# Altium schematic sheet 02 System_Block_Diagram.SchDoc: <Project Name>
size A3; ApprovedBy: <Appr.>; Author: <Author>; CompanyName: Infineon Technologies AG; Engineer: <Rel.>; Organization: Infineon Technologies AG; Address1: IFAG DES S PS; Address2: Am Campeon 1-12  -  85579 Neubiberg  -  Germany; Address3: 85579 Neubiberg; Address4: Germany; Revision: <Rev.>; SheetNumber: 2; Release: RC00; PageSetup: Record=PageOptions|CenterHorizontal=True|CenterVertical=True|PrintScale=1.01|XCorrection=1.00|YCorrection=1.00|PrintKind=0|BorderSize=5000000|LeftOffset=0|BottomOffset=0|Orientation=2|PaperLength=1000|PaperWidth=1000|Scale=100|PaperSource=7|PrintQuality=-4|MediaType=1|DitherType=10|PaperKind=A3|PrintScaleMode=1; Doc_ConfidentialStatus: <Doc_ConfidentialStatus>; Doc_Preliminary: <Doc_Preliminary>
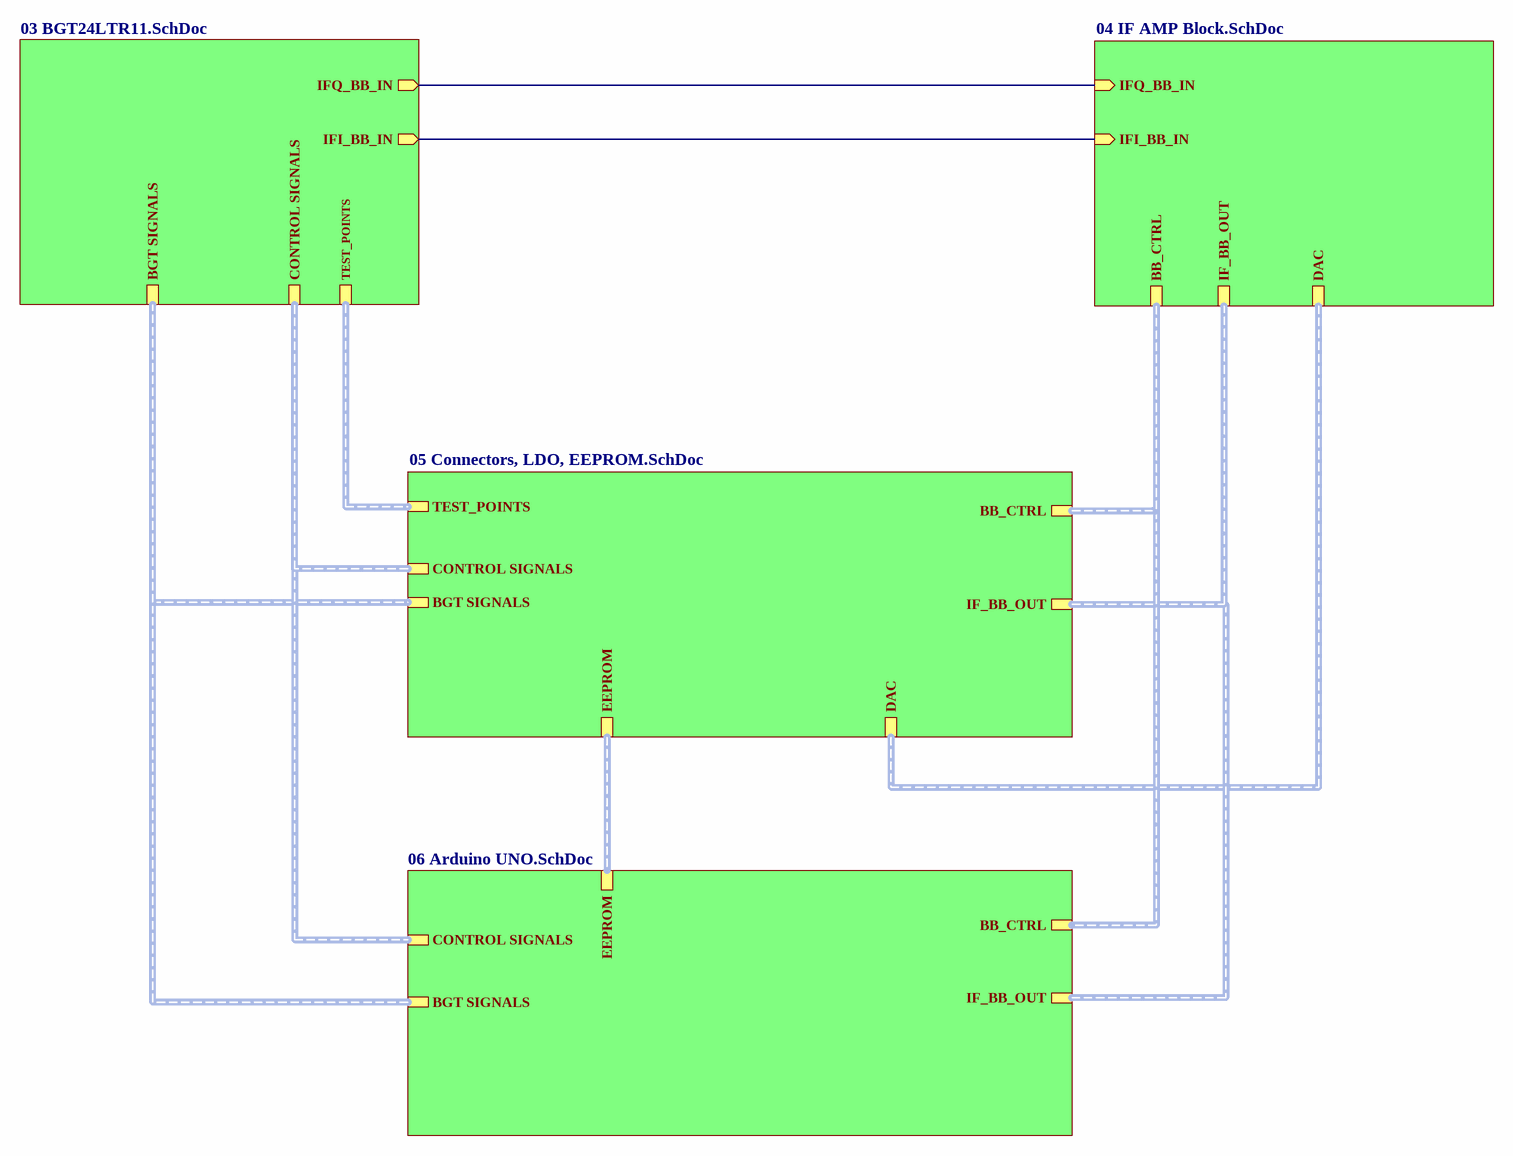
[diagram p0: 02 System_Block_Diagram.SchDoc]

## Sub-sheets
U_02 BGT24LTR11 = 03 BGT24LTR11.SchDoc: BGT SIGNALS (harness BGT_signals), CONTROL SIGNALS (harness BGT_CTRL), IFI_BB_IN (out), IFQ_BB_IN (out), TEST_POINTS (harness TEST_POINTS)
U_03 S&H, IF AMP Block = 04 IF AMP Block.SchDoc: DAC (harness DAC), IF_BB_OUT (harness IF_BB_OUT), BB_CTRL (harness BB_CTRL), IFQ_BB_IN (in), IFI_BB_IN (in)
U_04 Connector & Level Shifter Block = 05 Connectors, LDO, EEPROM.SchDoc: EEPROM (harness EEPROM), CONTROL SIGNALS (harness BGT_CTRL), DAC (harness DAC), BGT SIGNALS (harness BGT_signals), IF_BB_OUT (harness IF_BB_OUT), BB_CTRL (harness BB_CTRL), TEST_POINTS (harness TEST_POINTS)
U_05 Arduino UNO = 06 Arduino UNO.SchDoc: EEPROM (harness EEPROM), BGT SIGNALS (harness BGT_signals), IF_BB_OUT (harness IF_BB_OUT), CONTROL SIGNALS (harness BGT_CTRL), BB_CTRL (harness BB_CTRL)

## Nets
(unnamed): sheet U_02 BGT24LTR11/IFI_BB_IN, sheet U_03 S&H, IF AMP Block/IFI_BB_IN
(unnamed): sheet U_02 BGT24LTR11/IFQ_BB_IN, sheet U_03 S&H, IF AMP Block/IFQ_BB_IN

## Buses and harness runs
harness sheet U_02 BGT24LTR11/BGT SIGNALS = sheet U_04 Connector & Level Shifter Block/BGT SIGNALS = sheet U_05 Arduino UNO/BGT SIGNALS
harness sheet U_02 BGT24LTR11/CONTROL SIGNALS = sheet U_04 Connector & Level Shifter Block/CONTROL SIGNALS = sheet U_05 Arduino UNO/CONTROL SIGNALS
harness sheet U_02 BGT24LTR11/TEST_POINTS = sheet U_04 Connector & Level Shifter Block/TEST_POINTS
harness sheet U_03 S&H, IF AMP Block/BB_CTRL = sheet U_04 Connector & Level Shifter Block/BB_CTRL = sheet U_05 Arduino UNO/BB_CTRL
harness sheet U_03 S&H, IF AMP Block/DAC = sheet U_04 Connector & Level Shifter Block/DAC
harness sheet U_03 S&H, IF AMP Block/IF_BB_OUT = sheet U_04 Connector & Level Shifter Block/IF_BB_OUT = sheet U_05 Arduino UNO/IF_BB_OUT
harness sheet U_04 Connector & Level Shifter Block/EEPROM = sheet U_05 Arduino UNO/EEPROM

## Notes on the sheet
- Title
- Variant
- Approved
- Date:
- Author:
- Size:
- A3
- Document Name
- Time:
- SVN Revision:
- Rel.
- Rev.
- Sheet
- of